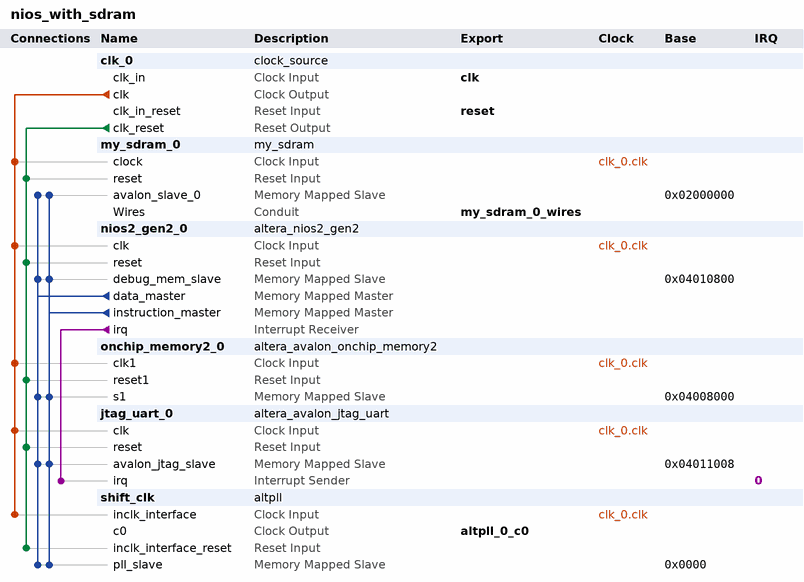
[diagram p0: system contents]
# Platform Designer (Qsys) system nios_with_sdram, Cyclone IV E EP4CE22F17C6
# Parameters at their usual value, and those the tool derives, are not listed.
package require -exact qsys 17.1
create_system nios_with_sdram
set_project_property DEVICE_FAMILY {Cyclone IV E}
set_project_property DEVICE EP4CE22F17C6

add_instance clk_0 clock_source 17.1
set_instance_parameter_value clk_0 clockFrequency 50000000

add_instance my_sdram_0 my_sdram 1.0

add_instance nios2_gen2_0 altera_nios2_gen2 17.1
set_instance_parameter_value nios2_gen2_0 dcache_size 2048
set_instance_parameter_value nios2_gen2_0 exceptionSlave onchip_memory2_0.s1
set_instance_parameter_value nios2_gen2_0 icache_size 4096
set_instance_parameter_value nios2_gen2_0 impl Tiny
set_instance_parameter_value nios2_gen2_0 resetSlave onchip_memory2_0.s1

add_instance onchip_memory2_0 altera_avalon_onchip_memory2 17.1
set_instance_parameter_value onchip_memory2_0 dataWidth 32
set_instance_parameter_value onchip_memory2_0 dualPort false
set_instance_parameter_value onchip_memory2_0 initMemContent true
set_instance_parameter_value onchip_memory2_0 initializationFileName onchip_mem.hex
set_instance_parameter_value onchip_memory2_0 memorySize 32768

add_instance jtag_uart_0 altera_avalon_jtag_uart 17.1
set_instance_parameter_value jtag_uart_0 simInteractiveOptions NO_INTERACTIVE_WINDOWS

add_instance shift_clk altpll 17.1
set_instance_parameter_value shift_clk CLK0_DIVIDE_BY 1
set_instance_parameter_value shift_clk CLK0_MULTIPLY_BY 1
set_instance_parameter_value shift_clk CLK0_PHASE_SHIFT -3000
set_instance_parameter_value shift_clk INCLK0_INPUT_FREQUENCY 20000
set_instance_parameter_value shift_clk PORT_ARESET PORT_UNUSED
set_instance_parameter_value shift_clk PORT_LOCKED PORT_UNUSED
set_instance_parameter_value shift_clk PORT_clk1 PORT_UNUSED
set_instance_parameter_value shift_clk PORT_clk2 PORT_UNUSED
set_instance_parameter_value shift_clk PORT_clk3 PORT_UNUSED

# connections
add_connection clk_0.clk jtag_uart_0.clk clock
add_connection clk_0.clk my_sdram_0.clock clock
add_connection clk_0.clk nios2_gen2_0.clk clock
add_connection clk_0.clk onchip_memory2_0.clk1 clock
add_connection clk_0.clk shift_clk.inclk_interface clock
add_connection clk_0.clk_reset jtag_uart_0.reset reset
add_connection clk_0.clk_reset my_sdram_0.reset reset
add_connection clk_0.clk_reset nios2_gen2_0.reset reset
add_connection clk_0.clk_reset onchip_memory2_0.reset1 reset
add_connection clk_0.clk_reset shift_clk.inclk_interface_reset reset
add_connection nios2_gen2_0.data_master jtag_uart_0.avalon_jtag_slave avalon
set_connection_parameter_value nios2_gen2_0.data_master/jtag_uart_0.avalon_jtag_slave baseAddress 0x04011008
add_connection nios2_gen2_0.data_master my_sdram_0.avalon_slave_0 avalon
set_connection_parameter_value nios2_gen2_0.data_master/my_sdram_0.avalon_slave_0 baseAddress 0x02000000
add_connection nios2_gen2_0.data_master nios2_gen2_0.debug_mem_slave avalon
set_connection_parameter_value nios2_gen2_0.data_master/nios2_gen2_0.debug_mem_slave baseAddress 0x04010800
add_connection nios2_gen2_0.data_master onchip_memory2_0.s1 avalon
set_connection_parameter_value nios2_gen2_0.data_master/onchip_memory2_0.s1 baseAddress 0x04008000
add_connection nios2_gen2_0.data_master shift_clk.pll_slave avalon
set_connection_parameter_value nios2_gen2_0.data_master/shift_clk.pll_slave baseAddress 0x0000
add_connection nios2_gen2_0.instruction_master jtag_uart_0.avalon_jtag_slave avalon
set_connection_parameter_value nios2_gen2_0.instruction_master/jtag_uart_0.avalon_jtag_slave baseAddress 0x04011008
add_connection nios2_gen2_0.instruction_master my_sdram_0.avalon_slave_0 avalon
set_connection_parameter_value nios2_gen2_0.instruction_master/my_sdram_0.avalon_slave_0 baseAddress 0x02000000
add_connection nios2_gen2_0.instruction_master nios2_gen2_0.debug_mem_slave avalon
set_connection_parameter_value nios2_gen2_0.instruction_master/nios2_gen2_0.debug_mem_slave baseAddress 0x04010800
add_connection nios2_gen2_0.instruction_master onchip_memory2_0.s1 avalon
set_connection_parameter_value nios2_gen2_0.instruction_master/onchip_memory2_0.s1 baseAddress 0x04008000
add_connection nios2_gen2_0.instruction_master shift_clk.pll_slave avalon
set_connection_parameter_value nios2_gen2_0.instruction_master/shift_clk.pll_slave baseAddress 0x0000
add_connection nios2_gen2_0.irq jtag_uart_0.irq interrupt
set_connection_parameter_value nios2_gen2_0.irq/jtag_uart_0.irq irqNumber 0

# exported interfaces
add_interface altpll_0_c0 clock source
set_interface_property altpll_0_c0 EXPORT_OF shift_clk.c0
add_interface clk clock sink
set_interface_property clk EXPORT_OF clk_0.clk_in
add_interface my_sdram_0_wires conduit end
set_interface_property my_sdram_0_wires EXPORT_OF my_sdram_0.Wires
add_interface reset reset sink
set_interface_property reset EXPORT_OF clk_0.clk_in_reset

set_interconnect_requirement {$system} qsys_mm.clockCrossingAdapter HANDSHAKE
set_interconnect_requirement {$system} qsys_mm.enableEccProtection FALSE
set_interconnect_requirement {$system} qsys_mm.insertDefaultSlave FALSE
set_interconnect_requirement {$system} qsys_mm.maxAdditionalLatency 1

save_system nios_with_sdram.qsys
